# Altium project BLDC.PrjPcb
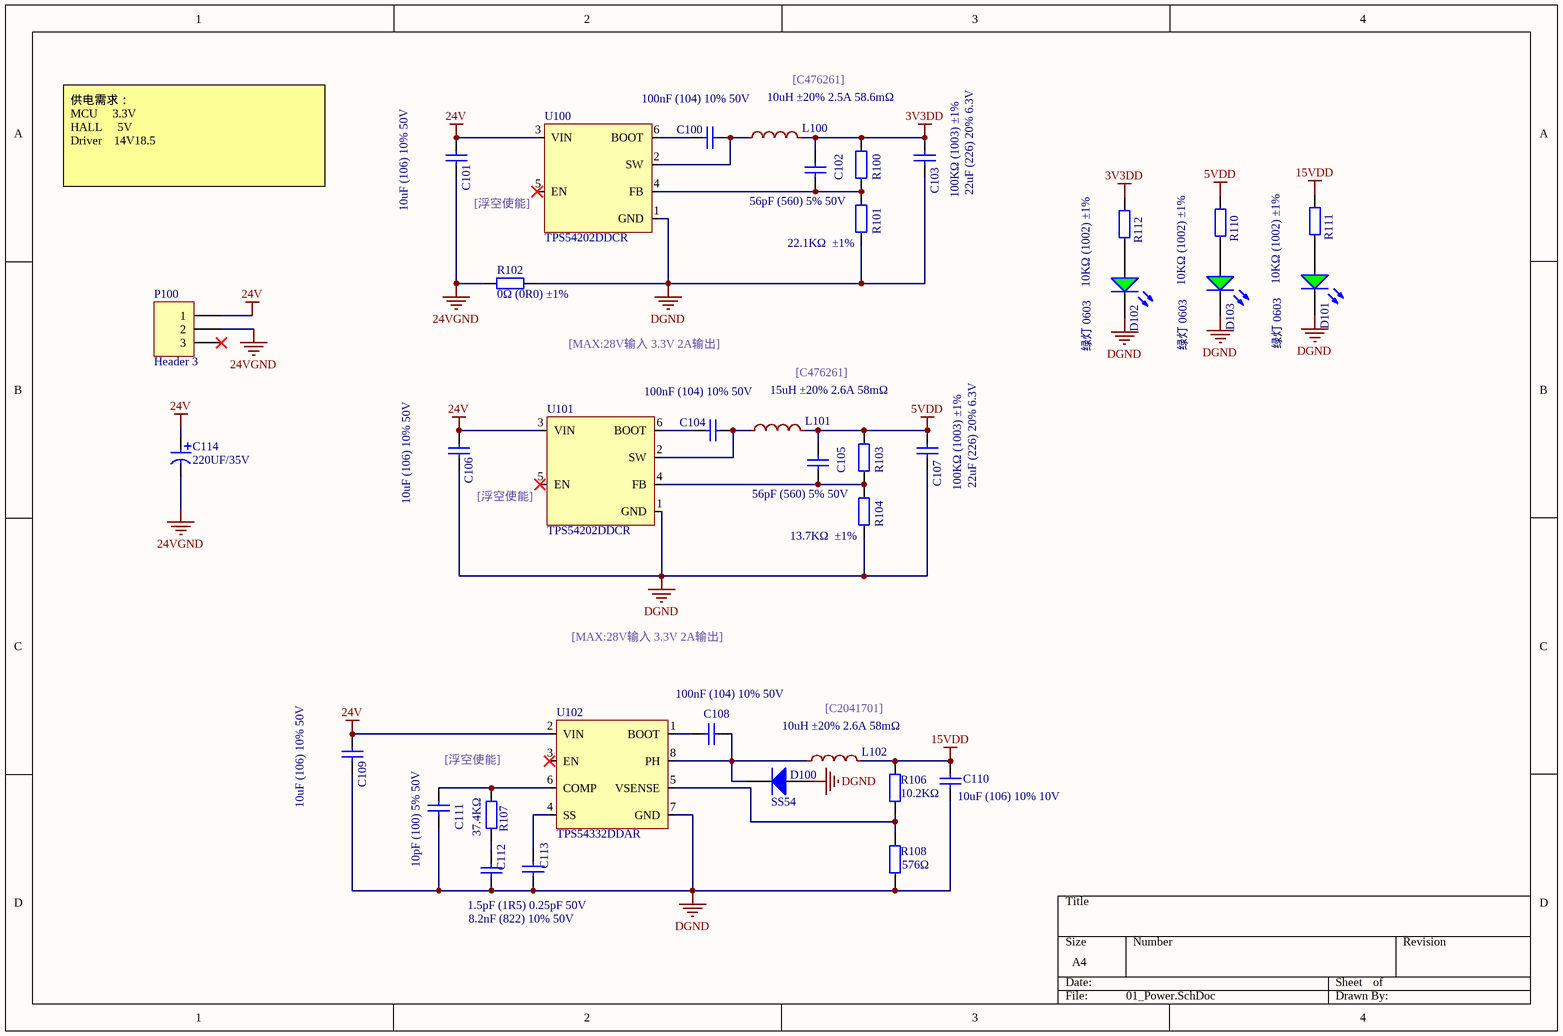
[diagram p0: 01_Power.SchDoc]
3 sheets, 118 parts. Net scope: global (net labels, ports and power ports of the same name join across sheets).
Board file: FOCV01.PcbDoc
Sheets:
  01_Power.SchDoc
  02_Mcu.SchDoc
  03_Sensor.SchDoc

## Sheet 01_Power.SchDoc
size A4

### Parts
C100  100nF (104) 10% 50V  [0603_C]
C101  10uF (106) 10% 50V  [0603_C]
C102  56pF (560) 5% 50V  [0603_C]
C103  22uF (226) 20% 6.3V  [0603_C]
C104  100nF (104) 10% 50V  [0603_C]
C105  56pF (560) 5% 50V  [0603_C]
C106  10uF (106) 10% 50V  [0603_C]
C107  22uF (226) 20% 6.3V  [0603_C]
C108  100nF (104) 10% 50V  [0603_C]
C109  10uF (106) 10% 50V  [0603_C]
C110  10uF (106) 10% 10V  [0603_C]
C111  10pF (100) 5% 50V  [0603_C]
C112  1.5pF (1R5) 0.25pF 50V  [0603_C]
C113  8.2nF (822) 10% 50V  [0603_C]
C114  220UF/35V  [CAP_L8.3_W8.3]
D100  SS54  [SMA(DO-214AC)_S1]
D101  绿灯 0603  [0603_LED_S1]
D102  绿灯 0603  [0603_LED_S1]
D103  绿灯 0603  [0603_LED_S1]
L100  10uH ±20% 2.5A 58.6mΩ  [L_SMD_L6_W6]
L101  15uH ±20% 2.6A 58mΩ  [L_SMD_L8_W8]
L102  10uH ±20% 2.6A 58mΩ  [L_SMD_L6_W6]
P100  Header 3  [KF2EDGK-3.81-WI-3P]
R100  100KΩ (1003) ±1%  [0603_R]
R101  22.1KΩ  ±1%  [0603_R]
R102  0Ω (0R0) ±1%  [LC-0805]
R103  100KΩ (1003) ±1%  [0603_R]
R104  13.7KΩ  ±1%  [0603_R]
R106  10.2KΩ  [0603_R]
R107  37.4KΩ  [0603_R]
R108  576Ω  [0603_R]
R110  10KΩ (1002) ±1%  [0603_R]
R111  10KΩ (1002) ±1%  [0603_R]
R112  10KΩ (1002) ±1%  [0603_R]
U100  TPS54202DDCR  [TPS54202DDCR]
U101  TPS54202DDCR  [TPS54202DDCR]
U102  TPS54332DDAR  [TPS54332DDAR]

### Nets
3V3DD: C102.2 C103.2 L100.2 R100.2 R112.2
5VDD: C105.2 C107.2 L101.2 R103.2 R110.2
15VDD: C110.1 L102.2 R106.2 R111.2
24V: C101.2 C106.2 C109.2 C114.1 P100.1 U100.3(VIN) U101.3(VIN) U102.2(VIN)
24VGND: C101.1 C114.2 P100.2 R102.1
DGND: C103.1 C106.1 C107.1 C109.1 C110.2 C111.1 C112.1 C113.1 D100.1(A) D101.K D102.K D103.K R101.1 R102.2 R104.1 R108.1 U100.1(GND) U101.1(GND) U102.7(GND)
NetC100_1: C100.1 U100.6(BOOT)
NetC100_2: C100.2 L100.1 U100.2(SW)
NetC102_1: C102.1 R100.1 R101.2 U100.4(FB)
NetC104_1: C104.1 U101.6(BOOT)
NetC104_2: C104.2 L101.1 U101.2(SW)
NetC105_1: C105.1 R103.1 R104.2 U101.4(FB)
NetC108_1: C108.1 U102.1(BOOT)
NetC108_2: C108.2 D100.2(K) L102.1 U102.8(PH)
NetC111_2: C111.2 R107.2 U102.6(COMP)
NetC112_2: C112.2 R107.1
NetC113_2: C113.2 U102.4(SS)
NetD101_A: D101.A R111.1
NetD102_A: D102.A R112.1
NetD103_A: D103.A R110.1
NetR106_1: R106.1 R108.2 U102.5(VSENSE)

Not connected (* = marked no-connect by the designer): P100 3*; U100 5(EN)*; U101 5(EN)*; U102 3(EN)*

### Notes on the sheet
- [C476261]
- 供电需求：
  MCU     3.3V
  HALL     5V
  Driver    14V18.5
- [浮空使能]
- [MAX:28V输入 3.3V 2A输出]
- [C2041701]

### Library data of the parts
C100 C104 C108 = 0603 100nF (104) 10% 50V: 贴片电容; ComponentLink1Description: 供应商链接; ComponentLink1URL: http://www.szlcsc.com/product/details_15331.html; Package: 0603; Supplier: LC; SuppliersPartNumber: C14663
C101 C106 C109 C110 = 0603 10uF (106) 10% 10V: 贴片电容; ComponentLink1Description: 供应商链接; ComponentLink1URL: http://www.szlcsc.com/product/details_20411.html; Package: 0603; Supplier: LC; SuppliersPartNumber: C19702
C102 C105 = 0603 56pF (560) 5% 50V: 贴片电容; ComponentLink1Description: 供应商链接; ComponentLink1URL: http://www.szlcsc.com/product/details_40131.html; Package: 0603; Supplier: LC; SuppliersPartNumber: C39148
C103 C107 = 0603 22uF (226) 20% 6.3V: 贴片电容; ComponentLink1Description: 供应商链接; ComponentLink1URL: http://www.szlcsc.com/product/details_60514.html; Package: 0603; Supplier: LC; SuppliersPartNumber: C59461
C111 = 0603 10pF (100) 5% 50V: 贴片电容; ComponentLink1Description: 供应商链接; ComponentLink1URL: http://www.szlcsc.com/product/details_1986.html; Package: 0603; Supplier: LC; SuppliersPartNumber: C1634
C112 = 0603 1.5pF (1R5) 0.25pF 50V: 贴片电容; ComponentLink1Description: 供应商链接; ComponentLink1URL: http://www.szlcsc.com/product/details_1991.html; Package: 0603; Supplier: LC; SuppliersPartNumber: C1639
C113 = 0603 8.2nF (822) 10% 50V: 贴片电容; ComponentLink1Description: 供应商链接; ComponentLink1URL: http://www.szlcsc.com/product/details_28670.html; Package: 0603; Supplier: LC; SuppliersPartNumber: C27920
C114 = CAP2: 电解电容
D100 = SMA(DO-214AC) SS54: 二极管; ComponentLink1Description: 供应商链接; ComponentLink1URL: http://www.szlcsc.com/product/details_23178.html; Package: SMA(DO-214AC); Supplier: LC; SuppliersPartNumber: C22452
D101-D103 = 0603 绿灯: 发光二极管; ComponentLink1Description: 供应商链接; ComponentLink1URL: http://www.szlcsc.com/product/details_73152.html; Package: 0603; Supplier: LC; SuppliersPartNumber: C72043
L100-L102 = L
P100 = Header 3: Header, 3-Pin; LatestRevisionDate: 17-Jul-2002; LatestRevisionNote: Re-released for DXP Platform.; Publisher: Altium Limited
R100 R101 R103 R104 = 0603 100KΩ (1003) 1%: 贴片电阻; ComponentLink1Description: 供应商链接; ComponentLink1URL: http://www.szlcsc.com/product/details_26546.html; Package: 0603; Supplier: LC; SuppliersPartNumber: C25803
R102 = 0603 0Ω (0R0) 1%: 贴片电阻; ComponentLink1Description: 供应商链接; ComponentLink1URL: http://www.szlcsc.com/product/details_21903.html; Package: 0603; Supplier: LC; SuppliersPartNumber: C21189
R106-R108 R110-R112 = 0603 10KΩ (1002) 1%: 贴片电阻; ComponentLink1Description: 供应商链接; ComponentLink1URL: http://www.szlcsc.com/product/details_26547.html; Package: 0603; Supplier: LC; SuppliersPartNumber: C25804

## Sheet 02_Mcu.SchDoc
size A4
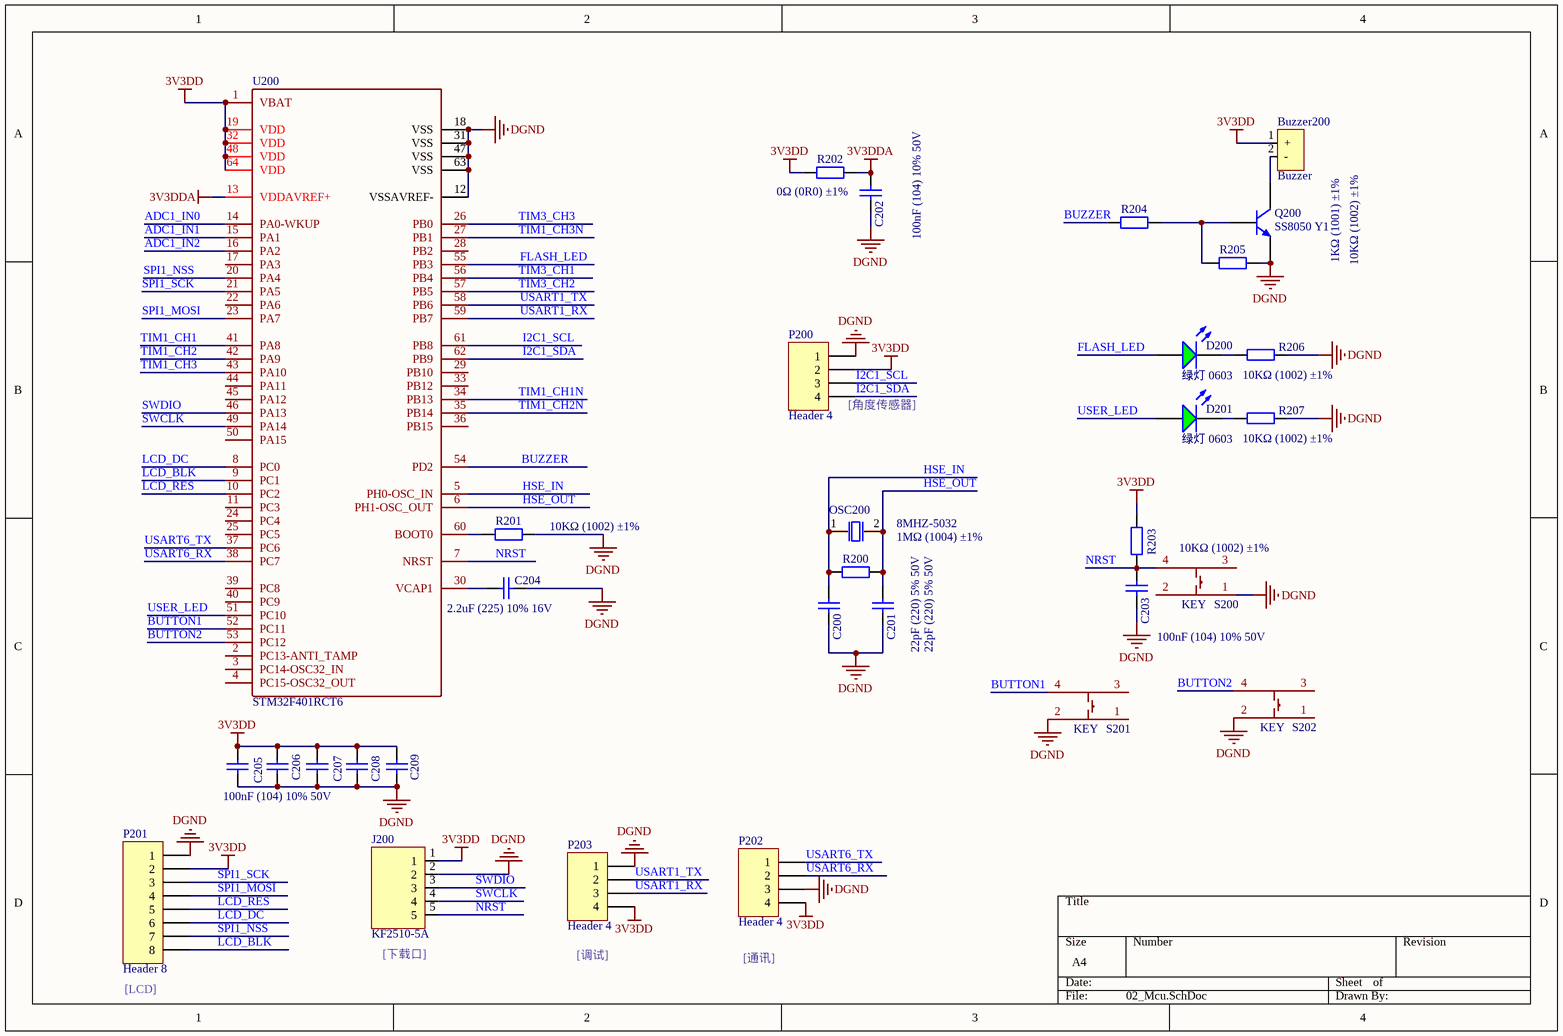
[diagram p1: 02_Mcu.SchDoc]

### Parts
Buzzer200  Buzzer  [buzzer-0905]
C200  22pF (220) 5% 50V  [0603_C]
C201  22pF (220) 5% 50V  [0603_C]
C202  100nF (104) 10% 50V  [0603_C]
C203  100nF (104) 10% 50V  [0603_C]
C204  2.2uF (225) 10% 16V  [0603_C]
C205  100nF (104) 10% 50V  [LC-0603_C]
C206  100nF (104) 10% 50V  [LC-0603_C]  (value not drawn)
C207  100nF (104) 10% 50V  [LC-0603_C]  (value not drawn)
C208  100nF (104) 10% 50V  [LC-0603_C]  (value not drawn)
C209  100nF (104) 10% 50V  [LC-0603_C]  (value not drawn)
D200  绿灯 0603  [0603_LED_S1]
D201  绿灯 0603  [0603_LED_S1]
J200  KF2510-5A  [KF2510-5A]
OSC200  8MHZ-5032  [8MHZ-5032]
P200  Header 4  [HDR1X4]
P201  Header 8  [HDR1X8]
P202  Header 4  [HDR1X4]
P203  Header 4  [HDR1X4]
Q200  SS8050 Y1  [SOT-23(SOT-23-3)]
R200  1MΩ (1004) ±1%  [0603_R]
R201  10KΩ (1002) ±1%  [0603_R]
R202  0Ω (0R0) ±1%  [0603_R]
R203  10KΩ (1002) ±1%  [0603_R]
R204  1KΩ (1001) ±1%  [0603_R]
R205  10KΩ (1002) ±1%  [0603_R]
R206  10KΩ (1002) ±1%  [0603_R]
R207  10KΩ (1002) ±1%  [0603_R]
S200  KEY  [KEY_WHITE]
S201  KEY  [KEY_WHITE]
S202  KEY  [KEY_WHITE]
U200  STM32F401RCT6  [STM32F401RCT6]

### Nets
3V3DD: Buzzer200.1(+) C205.2 C206.2 C207.2 C208.2 C209.2 J200.1 P200.2 P201.2 P202.4 P203.4 R202.1 R203.2 U200.1(VBAT) U200.19(VDD) U200.32(VDD) U200.48(VDD) U200.64(VDD)
3V3DDA: C202.2 R202.2 U200.13(VDDAVREF+)
DGND: C200.1 C201.1 C202.1 C203.1 C204.2 C205.1 C206.1 C207.1 C208.1 C209.1 J200.2 P200.1 P201.1 P202.3 P203.1 Q200.2(E) R201.2 R205.2 R206.2 R207.2 S200.1 S201.2 S202.2 U200.12(VSSAVREF-) U200.18(VSS) U200.31(VSS) U200.47(VSS) U200.63(VSS)
ADC1_IN0: U200.14(PA0-WKUP)
ADC1_IN1: U200.15(PA1)
ADC1_IN2: U200.16(PA2)
BUTTON1: S201.4 U200.52(PC11)
BUTTON2: S202.4 U200.53(PC12)
BUZZER: R204.1 U200.54(PD2)
FLASH_LED: D200.A U200.55(PB3)
HSE_IN: C200.2 OSC200.1(OSC1) R200.1 U200.5(PH0-OSC_IN)
HSE_OUT: C201.2 OSC200.2(OSC2) R200.2 U200.6(PH1-OSC_OUT)
I2C1_SCL: P200.3 U200.61(PB8)
I2C1_SDA: P200.4 U200.62(PB9)
LCD_BLK: P201.8 U200.9(PC1)
LCD_DC: P201.6 U200.8(PC0)
LCD_RES: P201.5 U200.10(PC2)
NRST: C203.2 J200.5 R203.1 S200.4 U200.7(NRST)
SPI1_MOSI: P201.4 U200.23(PA7)
SPI1_NSS: P201.7 U200.20(PA4)
SPI1_SCK: P201.3 U200.21(PA5)
SWCLK: J200.4 U200.49(PA14)
SWDIO: J200.3 U200.46(PA13)
TIM1_CH1: U200.41(PA8)
TIM1_CH1N: U200.34(PB13)
TIM1_CH2: U200.42(PA9)
TIM1_CH2N: U200.35(PB14)
TIM1_CH3: U200.43(PA10)
TIM1_CH3N: U200.27(PB1)
TIM3_CH1: U200.56(PB4)
TIM3_CH2: U200.57(PB5)
TIM3_CH3: U200.26(PB0)
USART1_RX: P203.3 U200.59(PB7)
USART1_TX: P203.2 U200.58(PB6)
USART6_RX: P202.2 U200.38(PC7)
USART6_TX: P202.1 U200.37(PC6)
USER_LED: D201.A U200.51(PC10)
NetBuzzer200_2: Buzzer200.2(-) Q200.3(C)
NetC204_1: C204.1 U200.30(VCAP1)
NetD200_K: D200.K R206.1
NetD201_K: D201.K R207.1
NetQ200_1: Q200.1(B) R204.2 R205.1
NetR201_1: R201.1 U200.60(BOOT0)

Not connected (* = marked no-connect by the designer): S200 2 3; S201 1 3; S202 1 3; U200 2(PC13-ANTI_TAMP) 3(PC14-OSC32_IN) 4(PC15-OSC32_OUT) 11(PC3) 17(PA3) 22(PA6) 24(PC4) 25(PC5) 28(PB2) 29(PB10) 33(PB12) 36(PB15) 39(PC8) 40(PC9) 44(PA11) 45(PA12) 50(PA15)

### Notes on the sheet
- (near P200) [角度传感器]
- (near J200) [下载口]
- (near P203) [调试]
- (near P202) [通讯]
- (near P201) [LCD]

### Library data of the parts
C200 C201 = 0603 22pF (220) 5% 50V: 贴片电容; ComponentLink1Description: 供应商链接; ComponentLink1URL: http://www.szlcsc.com/product/details_2005.html; Package: 0603; Supplier: LC; SuppliersPartNumber: C1653
C202 C203 C205-C209 = 0603 100nF (104) 10% 50V: 贴片电容; ComponentLink1Description: 供应商链接; ComponentLink1URL: http://www.szlcsc.com/product/details_15331.html; Package: 0603; Supplier: LC; SuppliersPartNumber: C14663
C204 = 0603 2.2uF (225) 10% 16V: 贴片电容; ComponentLink1Description: 供应商链接; ComponentLink1URL: http://www.szlcsc.com/product/details_24366.html; Package: 0603; Supplier: LC; SuppliersPartNumber: C23630
D200 D201 = 0603 绿灯: 发光二极管; ComponentLink1Description: 供应商链接; ComponentLink1URL: http://www.szlcsc.com/product/details_73152.html; Package: 0603; Supplier: LC; SuppliersPartNumber: C72043
P200 P202 P203 = Header 4: Header, 4-Pin; LatestRevisionDate: 17-Jul-2002; LatestRevisionNote: Re-released for DXP Platform.; Publisher: Altium Limited
P201 = Header 8: Header, 8-Pin; LatestRevisionDate: 17-Jul-2002; LatestRevisionNote: Re-released for DXP Platform.; Publisher: Altium Limited
Q200 = SOT-23 SS8050 Y1: 三极管; ComponentLink1Description: 供应商链接; ComponentLink1URL: http://www.szlcsc.com/product/details_2507.html; Package: SOT-23; Supplier: LC; SuppliersPartNumber: C2150
R200 = 0603 1MΩ (1004) 1%: 贴片电阻; ComponentLink1Description: 供应商链接; ComponentLink1URL: http://www.szlcsc.com/product/details_23662.html; Package: 0603; Supplier: LC; SuppliersPartNumber: C22935
R201 R203 R205-R207 = 0603 10KΩ (1002) 1%: 贴片电阻; ComponentLink1Description: 供应商链接; ComponentLink1URL: http://www.szlcsc.com/product/details_26547.html; Package: 0603; Supplier: LC; SuppliersPartNumber: C25804
R202 = 0603 0Ω (0R0) 1%: 贴片电阻; ComponentLink1Description: 供应商链接; ComponentLink1URL: http://www.szlcsc.com/product/details_21903.html; Package: 0603; Supplier: LC; SuppliersPartNumber: C21189
R204 = 0603 1KΩ (1001) 1%: 贴片电阻; ComponentLink1Description: 供应商链接; ComponentLink1URL: http://www.szlcsc.com/product/details_21904.html; Package: 0603; Supplier: LC; SuppliersPartNumber: C21190
S200-S202 = KEY: 白色方块

## Sheet 03_Sensor.SchDoc
size A4
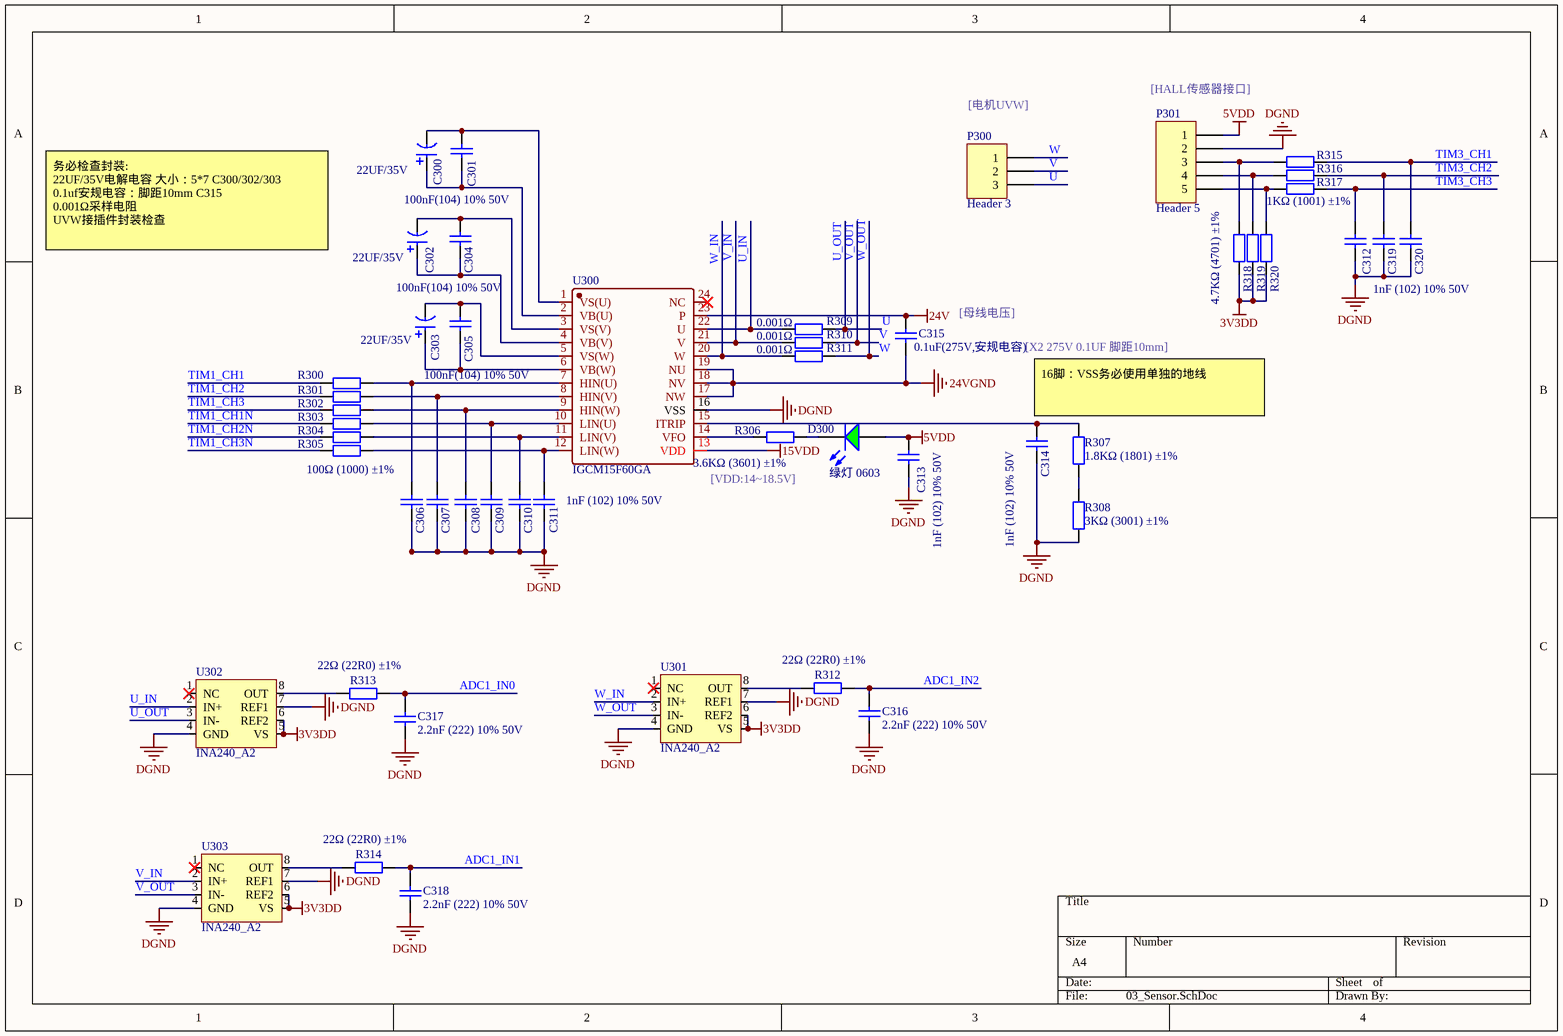
[diagram p2: 03_Sensor.SchDoc]

### Parts
C300  22UF/35V  [电解电容5*7]
C301  100nF(104) 10% 50V  [0805_C]
C302  22UF/35V  [电解电容5*7]
C303  22UF/35V  [电解电容5*7]
C304  100nF(104) 10% 50V  [0805_C]
C305  100nF(104) 10% 50V  [0805_C]
C306  1nF (102) 10% 50V  [0603_C]  (value not drawn)
C307  1nF (102) 10% 50V  [0603_C]  (value not drawn)
C308  1nF (102) 10% 50V  [0603_C]  (value not drawn)
C309  1nF (102) 10% 50V  [0603_C]  (value not drawn)
C310  1nF (102) 10% 50V  [0603_C]  (value not drawn)
C311  1nF (102) 10% 50V  [0603_C]
C312  1nF (102) 10% 50V  [0603_C]
C313  1nF (102) 10% 50V  [0603_C]
C314  1nF (102) 10% 50V  [0603_C]
C315  0.1uF(275V,安规电容)  [X2_安规电容_10MM]
C316  2.2nF (222) 10% 50V  [0603_C]
C317  2.2nF (222) 10% 50V  [0603_C]
C318  2.2nF (222) 10% 50V  [0603_C]
C319  1nF (102) 10% 50V  [0603_C]  (value not drawn)
C320  1nF (102) 10% 50V  [0603_C]  (value not drawn)
D300  绿灯 0603  [0603_LED_S1]
P300  Header 3  [KF2EDGK-3.81-WI-3P]
P301  Header 5  [KF2EDGK-3.81-WI-5P]
R300  100Ω (1000) ±1%  [0603_R]  (value not drawn)
R301  100Ω (1000) ±1%  [0603_R]  (value not drawn)
R302  100Ω (1000) ±1%  [0603_R]  (value not drawn)
R303  100Ω (1000) ±1%  [0603_R]  (value not drawn)
R304  100Ω (1000) ±1%  [0603_R]  (value not drawn)
R305  100Ω (1000) ±1%  [0603_R]
R306  3.6KΩ (3601) ±1%  [0603_R]
R307  1.8KΩ (1801) ±1%  [0603_R]
R308  3KΩ (3001) ±1%  [0603_R]
R309  0.001Ω  [R1206]
R310  0.001Ω  [R1206]
R311  0.001Ω  [R1206]
R312  22Ω (22R0) ±1%  [0603_R]
R313  22Ω (22R0) ±1%  [0603_R]
R314  22Ω (22R0) ±1%  [0603_R]
R315  1KΩ (1001) ±1%  [0603_R]  (value not drawn)
R316  1KΩ (1001) ±1%  [0603_R]  (value not drawn)
R317  1KΩ (1001) ±1%  [0603_R]
R318  4.7KΩ (4701) ±1%  [0603_R]  (value not drawn)
R319  4.7KΩ (4701) ±1%  [0603_R]  (value not drawn)
R320  4.7KΩ (4701) ±1%  [0603_R]
U300  IGCM15F60GA  [IGCM15F60GA]
U301  INA240_A2  [INA240A2PWR]
U302  INA240_A2  [INA240A2PWR]
U303  INA240_A2  [INA240A2PWR]

### Nets
3V3DD: R318.1 R319.1 R320.1 U301.5(VS) U301.6(REF2) U302.5(VS) U302.6(REF2) U303.5(VS) U303.6(REF2)
5VDD: C313.2 D300.A P301.1
15VDD: U300.13(VDD)
24V: C315.2 U300.23(P)
24VGND: C315.1 U300.17(NW) U300.18(NV) U300.19(NU)
DGND: C306.1 C307.1 C308.1 C309.1 C310.1 C311.1 C312.1 C313.1 C314.1 C316.1 C317.1 C318.1 C319.1 C320.1 P301.2 R308.1 U300.16(VSS) U301.4(GND) U301.7(REF1) U302.4(GND) U302.7(REF1) U303.4(GND) U303.7(REF1)
ADC1_IN0: C317.2 R313.2
ADC1_IN1: C318.2 R314.2
ADC1_IN2: C316.2 R312.2
TIM1_CH1: R300.1
TIM1_CH1N: R303.1
TIM1_CH2: R301.1
TIM1_CH2N: R304.1
TIM1_CH3: R302.1
TIM1_CH3N: R305.1
TIM3_CH1: C320.2 R315.2
TIM3_CH2: C319.2 R316.2
TIM3_CH3: C312.2 R317.2
U: P300.3 R309.2 U302.3(IN-)  [also labelled U_OUT]
U_IN: R309.1 U300.22(U) U302.2(IN+)
V: P300.2 R310.2 U303.3(IN-)  [also labelled V_OUT]
V_IN: R310.1 U300.21(V) U303.2(IN+)
W: P300.1 R311.2 U301.3(IN-)  [also labelled W_OUT]
W_IN: R311.1 U300.20(W) U301.2(IN+)
NetC300_1: C300.1 C301.1 U300.2(VB(U))
NetC300_2: C300.2 C301.2 U300.1(VS(U))
NetC302_1: C302.1 C304.1 U300.4(VB(V))
NetC302_2: C302.2 C304.2 U300.3(VS(V))
NetC303_1: C303.1 C305.1 U300.6(VB(W))
NetC303_2: C303.2 C305.2 U300.5(VS(W))
NetC306_2: C306.2 R300.2 U300.7(HIN(U))
NetC307_2: C307.2 R301.2 U300.8(HIN(V))
NetC308_2: C308.2 R302.2 U300.9(HIN(W))
NetC309_2: C309.2 R303.2 U300.10(LIN(U))
NetC310_2: C310.2 R304.2 U300.11(LIN(V))
NetC311_2: C311.2 R305.2 U300.12(LIN(W))
NetC314_2: C314.2 R307.2 U300.15(ITRIP)
NetD300_K: D300.K R306.2
NetP301_3: P301.3 R315.1 R318.2
NetP301_4: P301.4 R316.1 R319.2
NetP301_5: P301.5 R317.1 R320.2
NetR306_1: R306.1 U300.14(VFO)
NetR307_1: R307.1 R308.2
NetR312_1: R312.1 U301.8(OUT)
NetR313_1: R313.1 U302.8(OUT)
NetR314_1: R314.1 U303.8(OUT)

Not connected (* = marked no-connect by the designer): U300 24(NC)*; U301 1(NC)*; U302 1(NC)*; U303 1(NC)*

### Notes on the sheet
- (near P300) [电机UVW]
- (near P301) [HALL传感器接口]
- 务必检查封装:
  22UF/35V电解电容 大小：5*7 C300/302/303
  0.1uf安规电容：脚距10mm C315
  0.001Ω采样电阻
  UVW接插件封装检查
- (near C315) [母线电压]
- [X2 275V 0.1UF 脚距10mm]
- 16脚：VSS务必使用单独的地线
- [VDD:14~18.5V]

### Library data of the parts
C300 C302 C303 = CAP2: 电解电容
C301 C304 C305 = 0805 100nF(104) 10% 50V: 贴片电容; ComponentLink1Description: 供应商链接; ComponentLink1URL: http://www.szlcsc.com/product/details_50686.html; Package: 0805; Supplier: LC; SuppliersPartNumber: C49678
C306-C314 C319 C320 = 0603 1nF (102) 10% 50V: 贴片电容; ComponentLink1Description: 供应商链接; ComponentLink1URL: http://www.szlcsc.com/product/details_1940.html; Package: 0603; Supplier: LC; SuppliersPartNumber: C1588
C315 = 0603 100nF (104) 10% 50V: 贴片电容; ComponentLink1Description: 供应商链接; ComponentLink1URL: http://www.szlcsc.com/product/details_15331.html; Package: 0603; Supplier: LC; SuppliersPartNumber: C14663
C316-C318 = 0603 2.2nF (222) 10% 50V: 贴片电容; ComponentLink1Description: 供应商链接; ComponentLink1URL: http://www.szlcsc.com/product/details_1956.html; Package: 0603; Supplier: LC; SuppliersPartNumber: C1604
D300 = 0603 绿灯: 发光二极管; ComponentLink1Description: 供应商链接; ComponentLink1URL: http://www.szlcsc.com/product/details_73152.html; Package: 0603; Supplier: LC; SuppliersPartNumber: C72043
P300 = Header 3: Header, 3-Pin; LatestRevisionDate: 17-Jul-2002; LatestRevisionNote: Re-released for DXP Platform.; Publisher: Altium Limited
P301 = Header 5: Header, 5-Pin; LatestRevisionDate: 17-Jul-2002; LatestRevisionNote: Re-released for DXP Platform.; Publisher: Altium Limited
R300-R305 = 0603 100Ω (1000) 1%: 贴片电阻; ComponentLink1Description: 供应商链接; ComponentLink1URL: http://www.szlcsc.com/product/details_23502.html; Package: 0603; Supplier: LC; SuppliersPartNumber: C22775
R306 = 0603 3.6KΩ (3601) 1%: 贴片电阻; ComponentLink1Description: 供应商链接; ComponentLink1URL: http://www.szlcsc.com/product/details_23707.html; Package: 0603; Supplier: LC; SuppliersPartNumber: C22980
R307 = 0603 1.8KΩ (1801) 1%: 贴片电阻; ComponentLink1Description: 供应商链接; ComponentLink1URL: http://www.szlcsc.com/product/details_4584.html; Package: 0603; Supplier: LC; SuppliersPartNumber: C4177
R308 = 0603 3KΩ (3001) 1%: 贴片电阻; ComponentLink1Description: 供应商链接; ComponentLink1URL: http://www.szlcsc.com/product/details_4618.html; Package: 0603; Supplier: LC; SuppliersPartNumber: C4211
R309-R311 = 0805 10KΩ (1002) 1%: 贴片电阻; ComponentLink1Description: 供应商链接; ComponentLink1URL: http://www.szlcsc.com/product/details_18102.html; Package: 0805; Supplier: LC; SuppliersPartNumber: C17414
R312-R314 = 0603 22Ω (22R0) 1%: 贴片电阻; ComponentLink1Description: 供应商链接; ComponentLink1URL: http://www.szlcsc.com/product/details_24078.html; Package: 0603; Supplier: LC; SuppliersPartNumber: C23345
R315-R317 = 0603 1KΩ (1001) 1%: 贴片电阻; ComponentLink1Description: 供应商链接; ComponentLink1URL: http://www.szlcsc.com/product/details_21904.html; Package: 0603; Supplier: LC; SuppliersPartNumber: C21190
R318-R320 = 0603 4.7KΩ (4701) 1%: 贴片电阻; ComponentLink1Description: 供应商链接; ComponentLink1URL: http://www.szlcsc.com/product/details_23889.html; Package: 0603; Supplier: LC; SuppliersPartNumber: C23162

## Nets that join several sheets
3V3DD: 01_Power (5 pins), 02_Mcu (18 pins), 03_Sensor (9 pins)
5VDD: 01_Power (5 pins), 03_Sensor (C313.2 D300.A P301.1)
15VDD: 01_Power (C110.1 L102.2 R106.2 R111.2), 03_Sensor (U300.13)
24V: 01_Power (8 pins), 03_Sensor (C315.2 U300.23)
24VGND: 01_Power (C101.1 C114.2 P100.2 R102.1), 03_Sensor (C315.1 U300.17 U300.18 U300.19)
DGND: 01_Power (19 pins), 02_Mcu (28 pins), 03_Sensor (23 pins)
ADC1_IN0: 02_Mcu (U200.14), 03_Sensor (C317.2 R313.2)
ADC1_IN1: 02_Mcu (U200.15), 03_Sensor (C318.2 R314.2)
ADC1_IN2: 02_Mcu (U200.16), 03_Sensor (C316.2 R312.2)
TIM1_CH1: 02_Mcu (U200.41), 03_Sensor (R300.1)
TIM1_CH1N: 02_Mcu (U200.34), 03_Sensor (R303.1)
TIM1_CH2: 02_Mcu (U200.42), 03_Sensor (R301.1)
TIM1_CH2N: 02_Mcu (U200.35), 03_Sensor (R304.1)
TIM1_CH3: 02_Mcu (U200.43), 03_Sensor (R302.1)
TIM1_CH3N: 02_Mcu (U200.27), 03_Sensor (R305.1)
TIM3_CH1: 02_Mcu (U200.56), 03_Sensor (C320.2 R315.2)
TIM3_CH2: 02_Mcu (U200.57), 03_Sensor (C319.2 R316.2)
TIM3_CH3: 02_Mcu (U200.26), 03_Sensor (C312.2 R317.2)